# Altium project MCRO2440.PRJPCB
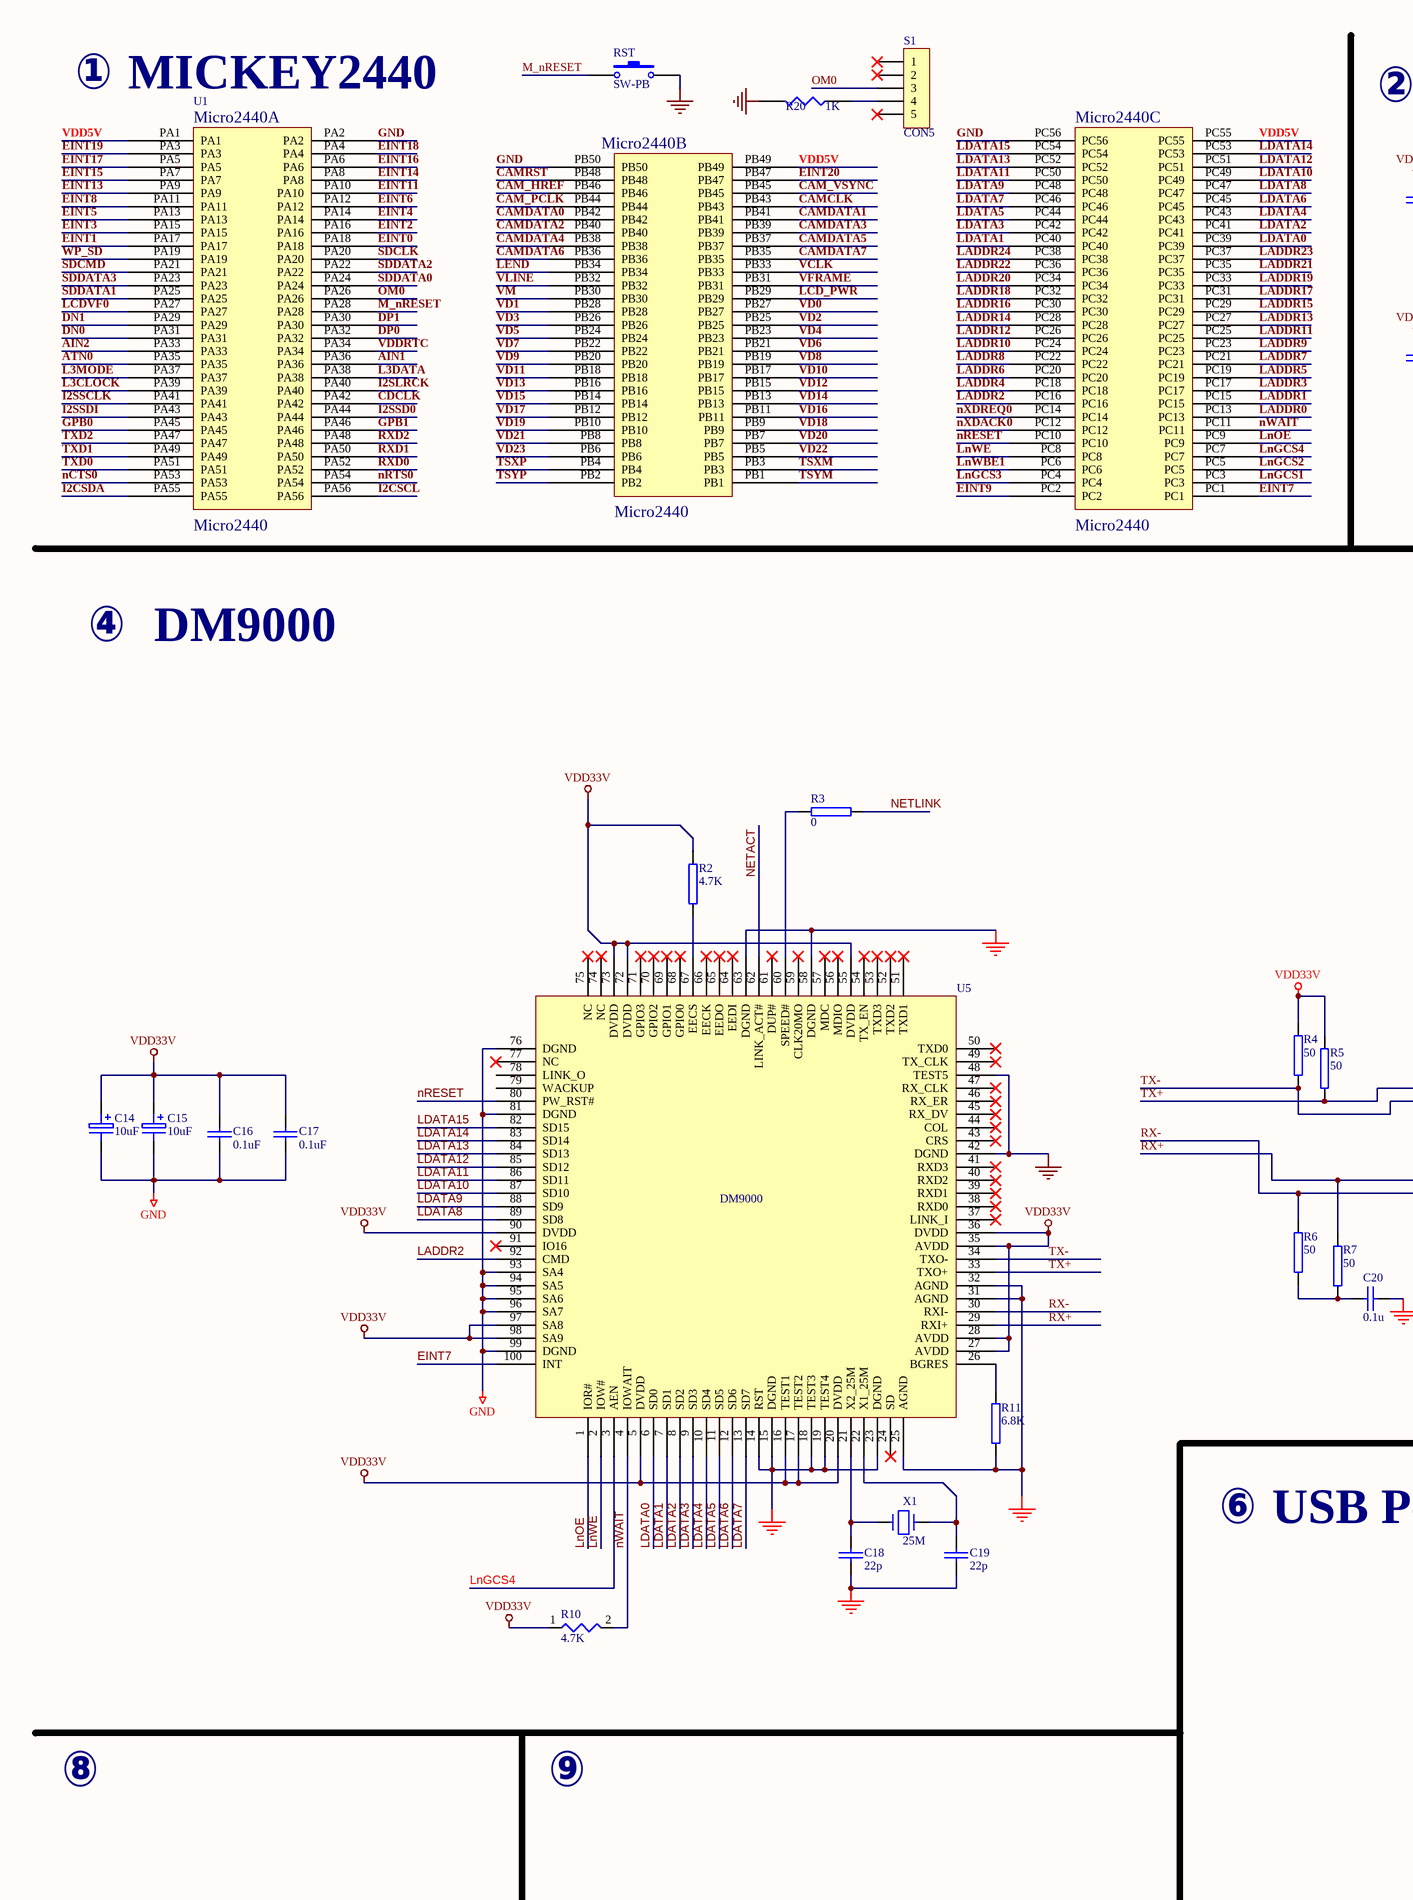
[diagram p0: mickey2440.SchDoc, left]
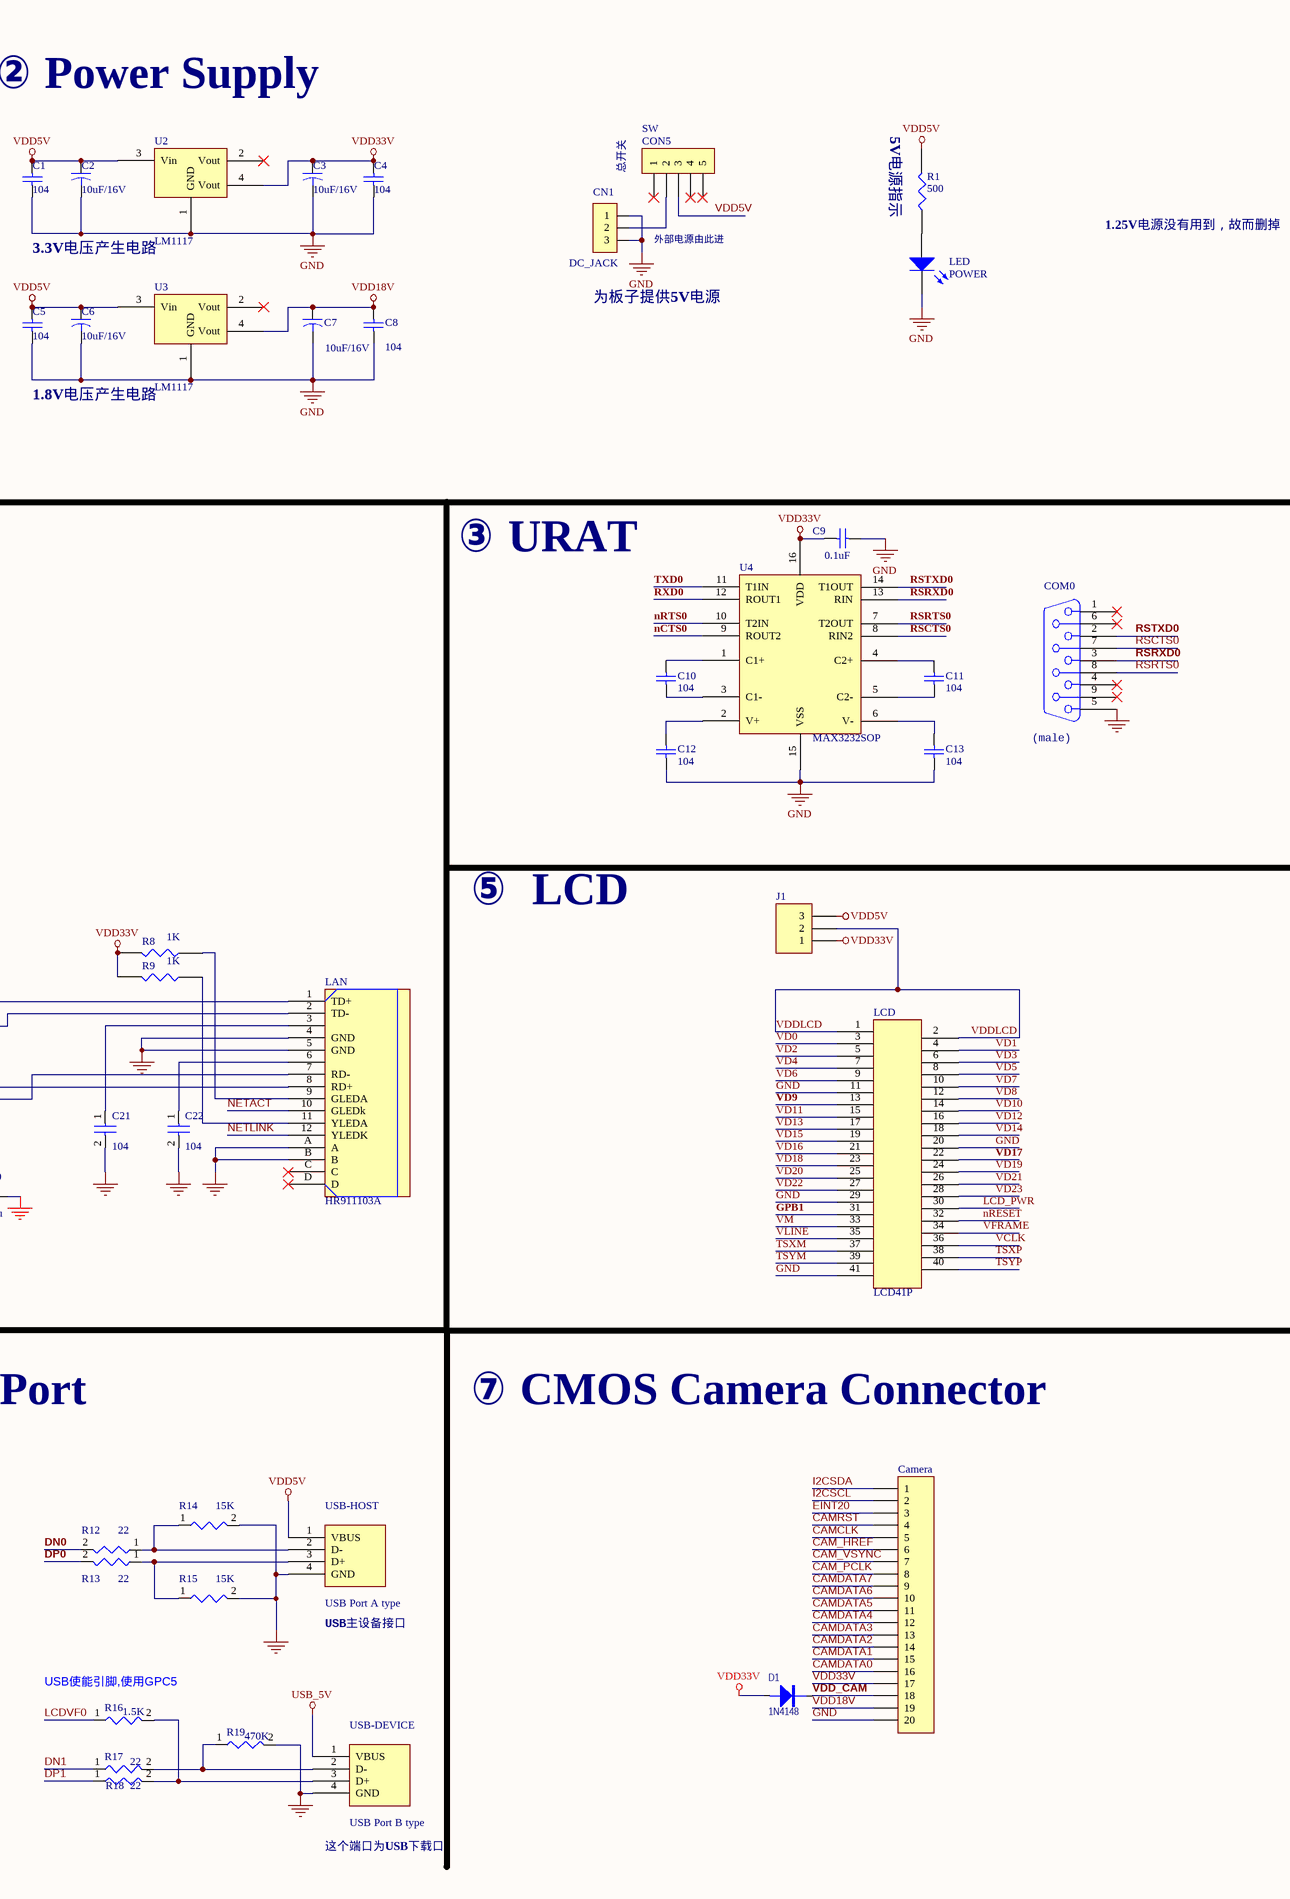
[diagram p1: mickey2440.SchDoc, right]
1 sheet, 61 parts. Net scope: global (net labels, ports and power ports of the same name join across sheets).
Board file: myPCB.PcbDoc

## Sheet mickey2440.SchDoc: Micro2440
size A2; Time: 2012.3.11

### Parts
C1  value 104  [0603A]  (hidden comment: Cap)
C2  value 10uF/16V  [C3216]  (hidden comment: Cap2)
C3  value 10uF/16V  [C3216]  (hidden comment: Cap2)
C4  value 104  [0603A]  (hidden comment: Cap)
C5  value 104  [0603A]  (hidden comment: Cap)
C6  value 10uF/16V  [C3216]  (hidden comment: Cap2)
C7  value 10uF/16V  [C3216]  (hidden comment: Cap2)
C8  value 104  [0603A]  (hidden comment: Cap)
C9  value 0.1uF  [0603A]  (hidden comment: Cap Semi)
C10  value 104  [0603A]  (hidden comment: Cap Semi)
C11  value 104  [0603A]  (hidden comment: Cap Semi)
C12  value 104  [0603A]  (hidden comment: Cap Semi)
C13  value 104  [0603A]  (hidden comment: Cap Semi)
C14  10uF  [C3216]
C15  10uF  [C3216]
C16  0.1uF  [0603A]
C17  0.1uF  [0603A]
C18  22p  [0603A]
C19  22p  [0603A]
C20  0.1u  [0603A]
C21  104  [0603A]
C22  104  [0603A]
Camera  CON20  [IDC20SS]  (value not drawn)
CN1  DC_JACK  [DC25]
COM0  (no value)  [DB9RA/M]
D1  1N4148  [D1206]
J1  (no value)  [HDR1X3]
LAN  HR911103A  [HR911103A]
LCD  LCD41P  [DF9B-41P-1V2]
LED  POWER  [LED]
R1  500  [0603R]
R2  4.7K  [0603R]
R3  0  [0603R]
R4  50  [0603R]
R5  50  [0603R]
R6  50  [0603R]
R7  50  [0603R]
R8  1K  [0603R]
R9  1K  [0603R]
R10  4.7K  [0603R]
R11  6.8K  [0603R]
R12  22  [0603R]
R13  22  [0603R]
R14  15K  [0603R]
R15  15K  [0603R]
R16  1.5K  [0603R]
R17  22  [0603R]
R18  22  [0603R]
R19  470K  [0603R]
R20  1K  [0603R]
RST  SW-PB  [RST]
S1  CON5  [PCBComponent_1]
SW  CON5  [PCBComponent_1]
U1  Micro2440  [MICRO2440]  (value not drawn)
U2  LM1117  [SOT223S]
U3  LM1117  [SOT223S]
U4  MAX3232SOP  [SSOP16]
U5  DM9000  [QFP100]
USB-DEVICE  USB Port B type  [USB-B]
USB-HOST  USB Port A type  [USB-A]
X1  25M  [OSC2PR-1]

### Nets
GND: C1.2 C2.2 C3.2 C4.2 C5.2 C6.2 C7.2 C8.2 C9.2 C12.1 C13.1 C14.2 C15.2 C16.2 C17.2 C18.2 C19.2 C20.2 C21.2 C22.2 Camera.20 CN1.1 CN1.3 COM0.5 LAN.4(GND) LAN.5(GND) LAN.A LAN.B LCD.11 LCD.20 LCD.29 LCD.41 LED.2(K) R11.1 R14.2 R15.2 R19.2 R20.2 RST.2 U1.PA2 U1.PB50 U1.PC56 U2.1(GND) U3.1(GND) U4.15(VSS) U5.14(RST) U5.15(DGND) U5.18(TEST3) U5.19(TEST4) U5.23(DGND) U5.25(AGND) U5.31(AGND) U5.32(AGND) U5.42(DGND) U5.48(TEST5) U5.58(DGND) U5.63(DGND) U5.76(DGND) U5.81(DGND) U5.93(SA4) U5.94(SA5) U5.95(SA6) U5.96(SA7) U5.99(DGND) USB-DEVICE.4(GND) USB-HOST.4(GND)
USB_5V: USB-DEVICE.1(VBUS)
VDD5V: C1.1 C2.1 C5.1 C6.1 J1.3 R1.2 SW.3 U1.PA1 U1.PB49 U1.PC55 U2.3(Vin) U3.3(Vin) USB-HOST.1(VBUS)
VDD18V: C7.1 C8.1 Camera.19 U3.4(Vout)
VDD33V: C3.1 C4.1 C9.1 C14.1 C15.1 C16.1 C17.1 Camera.17 D1.1 J1.1 R2.2 R4.2 R5.2 R8.2 R9.2 R10.1 U2.4(Vout) U4.16(VDD) U5.5(DVDD) U5.16(TEST1) U5.17(TEST2) U5.20(DVDD) U5.27(AVDD) U5.28(AVDD) U5.35(AVDD) U5.36(DVDD) U5.55(DVDD) U5.72(DVDD) U5.73(DVDD) U5.90(DVDD) U5.97(SA8) U5.98(SA9)
AIN1: U1.PA36
AIN2: U1.PA33
ATN0: U1.PA35
CAM_HREF: Camera.6 U1.PB46
CAM_PCLK: Camera.8 U1.PB44
CAM_VSYNC: Camera.7 U1.PB45
CAMCLK: Camera.5 U1.PB43
CAMDATA0: Camera.16 U1.PB42
CAMDATA1: Camera.15 U1.PB41
CAMDATA2: Camera.14 U1.PB40
CAMDATA3: Camera.13 U1.PB39
CAMDATA4: Camera.12 U1.PB38
CAMDATA5: Camera.11 U1.PB37
CAMDATA6: Camera.10 U1.PB36
CAMDATA7: Camera.9 U1.PB35
CAMRST: Camera.4 U1.PB48
CDCLK: U1.PA42
DN0: R12.2 U1.PA31
DN1: R17.1 U1.PA29
DP0: R13.2 U1.PA32
DP1: R18.1 U1.PA30
EINT0: U1.PA18
EINT1: U1.PA17
EINT2: U1.PA16
EINT3: U1.PA15
EINT4: U1.PA14
EINT5: U1.PA13
EINT6: U1.PA12
EINT7: U1.PC1 U5.100(INT)
EINT8: U1.PA11
EINT9: U1.PC2
EINT11: U1.PA10
EINT13: U1.PA9
EINT14: U1.PA8
EINT15: U1.PA7
EINT16: U1.PA6
EINT17: U1.PA5
EINT18: U1.PA4
EINT19: U1.PA3
EINT20: Camera.3 U1.PB47
GPB0: U1.PA45
GPB1: LCD.31 U1.PA46
I2CSCL: Camera.2 U1.PA56
I2CSDA: Camera.1 U1.PA55
I2SLRCK: U1.PA40
I2SSCLK: U1.PA41
I2SSD0: U1.PA44
I2SSDI: U1.PA43
L3CLOCK: U1.PA39
L3DATA: U1.PA38
L3MODE: U1.PA37
LADDR0: U1.PC13
LADDR1: U1.PC15
LADDR2: U1.PC16 U5.92(CMD)
LADDR3: U1.PC17
LADDR4: U1.PC18
LADDR5: U1.PC19
LADDR6: U1.PC20
LADDR7: U1.PC21
LADDR8: U1.PC22
LADDR9: U1.PC23
LADDR10: U1.PC24
LADDR11: U1.PC25
LADDR12: U1.PC26
LADDR13: U1.PC27
LADDR14: U1.PC28
LADDR15: U1.PC29
LADDR16: U1.PC30
LADDR17: U1.PC31
LADDR18: U1.PC32
LADDR19: U1.PC33
LADDR20: U1.PC34
LADDR21: U1.PC35
LADDR22: U1.PC36
LADDR23: U1.PC37
LADDR24: U1.PC38
LCD_PWR: LCD.30 U1.PB29
LCDVF0: R16.1 U1.PA27
LDATA0: U1.PC39 U5.6(SD0)
LDATA1: U1.PC40 U5.7(SD1)
LDATA2: U1.PC41 U5.8(SD2)
LDATA3: U1.PC42 U5.9(SD3)
LDATA4: U1.PC43 U5.10(SD4)
LDATA5: U1.PC44 U5.11(SD5)
LDATA6: U1.PC45 U5.12(SD6)
LDATA7: U1.PC46 U5.13(SD7)
LDATA8: U1.PC47 U5.89(SD8)
LDATA9: U1.PC48 U5.88(SD9)
LDATA10: U1.PC49 U5.87(SD10)
LDATA11: U1.PC50 U5.86(SD11)
LDATA12: U1.PC51 U5.85(SD12)
LDATA13: U1.PC52 U5.84(SD13)
LDATA14: U1.PC53 U5.83(SD14)
LDATA15: U1.PC54 U5.82(SD15)
LEND: U1.PB34
LnGCS1: U1.PC3
LnGCS2: U1.PC5
LnGCS3: U1.PC4
LnGCS4: U1.PC7 U5.3(AEN)
LnOE: U1.PC9 U5.1(IOR#)
LnWBE1: U1.PC6
LnWE: U1.PC8 U5.2(IOW#)
M_nRESET: RST.1 U1.PA28
nCTS0: U1.PA53 U4.9(ROUT2)
NETACT: LAN.10(GLEDk) U5.62(LINK_ACT#)
NETLINK: LAN.12(YLEDK) R3.1
nRESET: LCD.32 U1.PC10 U5.80(PW_RST#)
nRTS0: U1.PA54 U4.10(T2IN)
nWAIT: R10.2 U1.PC11 U5.4(IOWAIT)
nXDACK0: U1.PC12
nXDREQ0: U1.PC14
OM0: S1.3 U1.PA26
RSCTS0: COM0.7 U4.8(RIN2)
RSRTS0: COM0.8 U4.7(T2OUT)
RSRXD0: COM0.3 U4.13(RIN)
RSTXD0: COM0.2 U4.14(T1OUT)
RX+: LAN.8(RD+) R7.2 U5.29(RXI+)
RX-: LAN.7(RD-) R6.2 U5.30(RXI-)
RXD0: U1.PA52 U4.12(ROUT1)
RXD1: U1.PA50
RXD2: U1.PA48
SDCLK: U1.PA20
SDCMD: U1.PA21
SDDATA0: U1.PA24
SDDATA1: U1.PA25
SDDATA2: U1.PA22
SDDATA3: U1.PA23
TSXM: LCD.37 U1.PB3
TSXP: LCD.38 U1.PB4
TSYM: LCD.39 U1.PB1
TSYP: LCD.40 U1.PB2
TX+: LAN.1(TD+) R5.1 U5.33(TXO+)
TX-: LAN.2(TD-) R4.1 U5.34(TXO-)
TXD0: U1.PA51 U4.11(T1IN)
TXD1: U1.PA49
TXD2: U1.PA47
VCLK: LCD.36 U1.PB33
VD0: LCD.3 U1.PB27
VD1: LCD.4 U1.PB28
VD2: LCD.5 U1.PB25
VD3: LCD.6 U1.PB26
VD4: LCD.7 U1.PB23
VD5: LCD.8 U1.PB24
VD6: LCD.9 U1.PB21
VD7: LCD.10 U1.PB22
VD8: LCD.12 U1.PB19
VD9: LCD.13 U1.PB20
VD10: LCD.14 U1.PB17
VD11: LCD.15 U1.PB18
VD12: LCD.16 U1.PB15
VD13: LCD.17 U1.PB16
VD14: LCD.18 U1.PB13
VD15: LCD.19 U1.PB14
VD16: LCD.21 U1.PB11
VD17: LCD.22 U1.PB12
VD18: LCD.23 U1.PB9
VD19: LCD.24 U1.PB10
VD20: LCD.25 U1.PB7
VD21: LCD.26 U1.PB8
VD22: LCD.27 U1.PB5
VD23: LCD.28 U1.PB6
VDD_CAM: Camera.18 D1.2
VDDLCD: J1.2 LCD.1 LCD.2
VDDRTC: U1.PA34
VFRAME: LCD.34 U1.PB31
VLINE: LCD.35 U1.PB32
VM: LCD.33 U1.PB30
WP_SD: U1.PA19
NetC10_1: C10.1 U4.3(C1-)
NetC10_2: C10.2 U4.1(C1+)
NetC11_1: C11.1 U4.5(C2-)
NetC11_2: C11.2 U4.4(C2+)
NetC12_2: C12.2 U4.2(V+)
NetC13_2: C13.2 U4.6(V-)
NetC18_1: C18.1 U5.21(X2_25M) X1.1
NetC19_1: C19.1 U5.22(X1_25M) X1.2
NetC20_1: C20.1 R6.1 R7.1
NetC21_1: C21.1 LAN.3
NetC22_1: C22.1 LAN.6
NetCN1_2: CN1.2 SW.2
NetLAN_9: LAN.9(GLEDA) R8.1
NetLAN_11: LAN.11(YLEDA) R9.1
NetLED_1: LED.1(A) R1.1
NetR2_1: R2.1 U5.67(EECS)
NetR3_2: R3.2 U5.60(SPEED#)
NetR11_2: R11.2 U5.26(BGRES)
NetR12_1: R12.1 R14.1 USB-HOST.2(D-)
NetR13_1: R13.1 R15.1 USB-HOST.3(D+)
NetR16_2: R16.2 R18.2 USB-DEVICE.3(D+)
NetR17_2: R17.2 R19.1 USB-DEVICE.2(D-)
NetR20_1: R20.1 S1.4

Not connected (* = marked no-connect by the designer): COM0 1* 4* 6* 9*; LAN C* D*; S1 1* 2* 5*; SW 1* 4* 5*; U2 2(Vout)*; U3 2(Vout)*; U5 24(SD)* 37(LINK_I)* 38(RXD0)* 39(RXD1)* 40(RXD2)* 41(RXD3)* 43(CRS)* 44(COL)* 45(RX_DV)* 46(RX_ER)* 47(RX_CLK)* 49(TX_CLK)* 50(TXD0)* 51(TXD1)* 52(TXD2)* 53(TXD3)* 54(TX_EN)* 56(MDIO)* 57(MDC)* 59(CLK20MO)* 61(DUP#)* 64(EEDI)* 65(EEDO)* 66(EECK)* 68(GPIO0)* 69(GPIO1)* 70(GPIO2)* 71(GPIO3)* 74(NC)* 75(NC)* 77(NC)* 78(LINK_O) 79(WACKUP) 91(IO16)*

### Notes on the sheet
- ①
- (near U1) MICKEY2440
- ②
- Power Supply
- (near R1) 5V电源指示
- (near SW) 总开关
- 3.3V电压产生电路
- (near CN1) 外部电源由此进
- 1.25V电源没有用到，故而删掉
- 为板子提供5V电源
- 1.8V电压产生电路
- ③
- URAT
- ④
- DM9000
- (near COM0) (male)
- ⑤
- LCD
- ⑥
- USB Port
- ⑦
- CMOS Camera Connector
- ⑧
- ⑨
- (near R16) USB使能引脚,使用GPC5
- (near USB-HOST) USB主设备接口
- (near USB-DEVICE) 这个端口为USB下载口
- (in symbol Component_1) Micro2440A; Micro2440C; Micro2440B

### Library data of the parts
C1 C4 C5 C8 = Cap: Capacitor; Published: 8-Jun-2000; LatestRevisionDate: 17-Jul-2002; LatestRevisionNote: Re-released for DXP Platform.; PackageReference: RAD-0.3; Publisher: Altium Limited; PackageDescription: Radial Cap, Thru-Hole; 2 Leads; 0.3 in Pin Spacing
C2 C3 C6 C7 = Cap2: Capacitor; Published: 23-Sep-2002; PackageReference: CAPR5-4X5; Publisher: Altium Limited; PackageDescription: Capacitor; 2 Leads
C9-C13 = Cap Semi: Capacitor (Semiconductor SIM Model); Published: 8-Jun-2000; LatestRevisionDate: 29-May-2009; LatestRevisionNote: IPC-7351 Footprint Added.; PackageReference: C1206; Publisher: Altium Limited; PackageDescription: Chip Capacitor
C14 C15 = ELECTRO1
C16-C20 = CAP
C21 C22 = CAP NP_0: Text Field1: 20; Text Field2: 10
Camera = CON20: Connector
CN1 = CON3: Text Field1: 20; Text Field2: 40
COM0 = CONNECTOR DB9: Text Field1: 30; Text Field2: 100
D1 = DIODE
J1 = Header 3: Header, 3-Pin; LatestRevisionDate: 17-Jul-2002; LatestRevisionNote: Re-released for DXP Platform.; Publisher: Altium Limited
LED = LED3: Typical BLUE SiC LED; Published: 8-Jun-2000; LatestRevisionDate: 17-Dec-2003; LatestRevisionNote: PCB Footprint replaced.; DatasheetVersion: 16-Apr-2002; PackageVersion: 16-Apr-2002; PackageReference: 3.5X2.8X1.9; Publisher: Altium Limited; PackageDescription: SM LED; 2 C-Bend Leads; Body 3.5 x 2.8 x 1.9 mm, inc leads (LxWxH typ)
R1 R8 R9 R20 = RES1
R2-R7 R11 = RES2
R10 = R_0: Text Field1: 20; Text Field2: 30
R12-R19 = RESISTOR_2: Text Field1: 20; Text Field2: 30
RST = SW-PB: Switch; Published: 24-Mar-1999; LatestRevisionDate: 17-Jul-2002; LatestRevisionNote: Re-released for DXP Platform.; PackageReference: SPST-2; Publisher: Altium Limited; PackageDescription: Switch; 2 Leads
S1 SW = CON5: Connector
U1 U4 = Component_1
USB-DEVICE USB-HOST = USBPORT: Text Field1: 50; Text Field2: 50
X1 = CRYSTAL